# Altium schematic sheet State.SchDoc
size A4
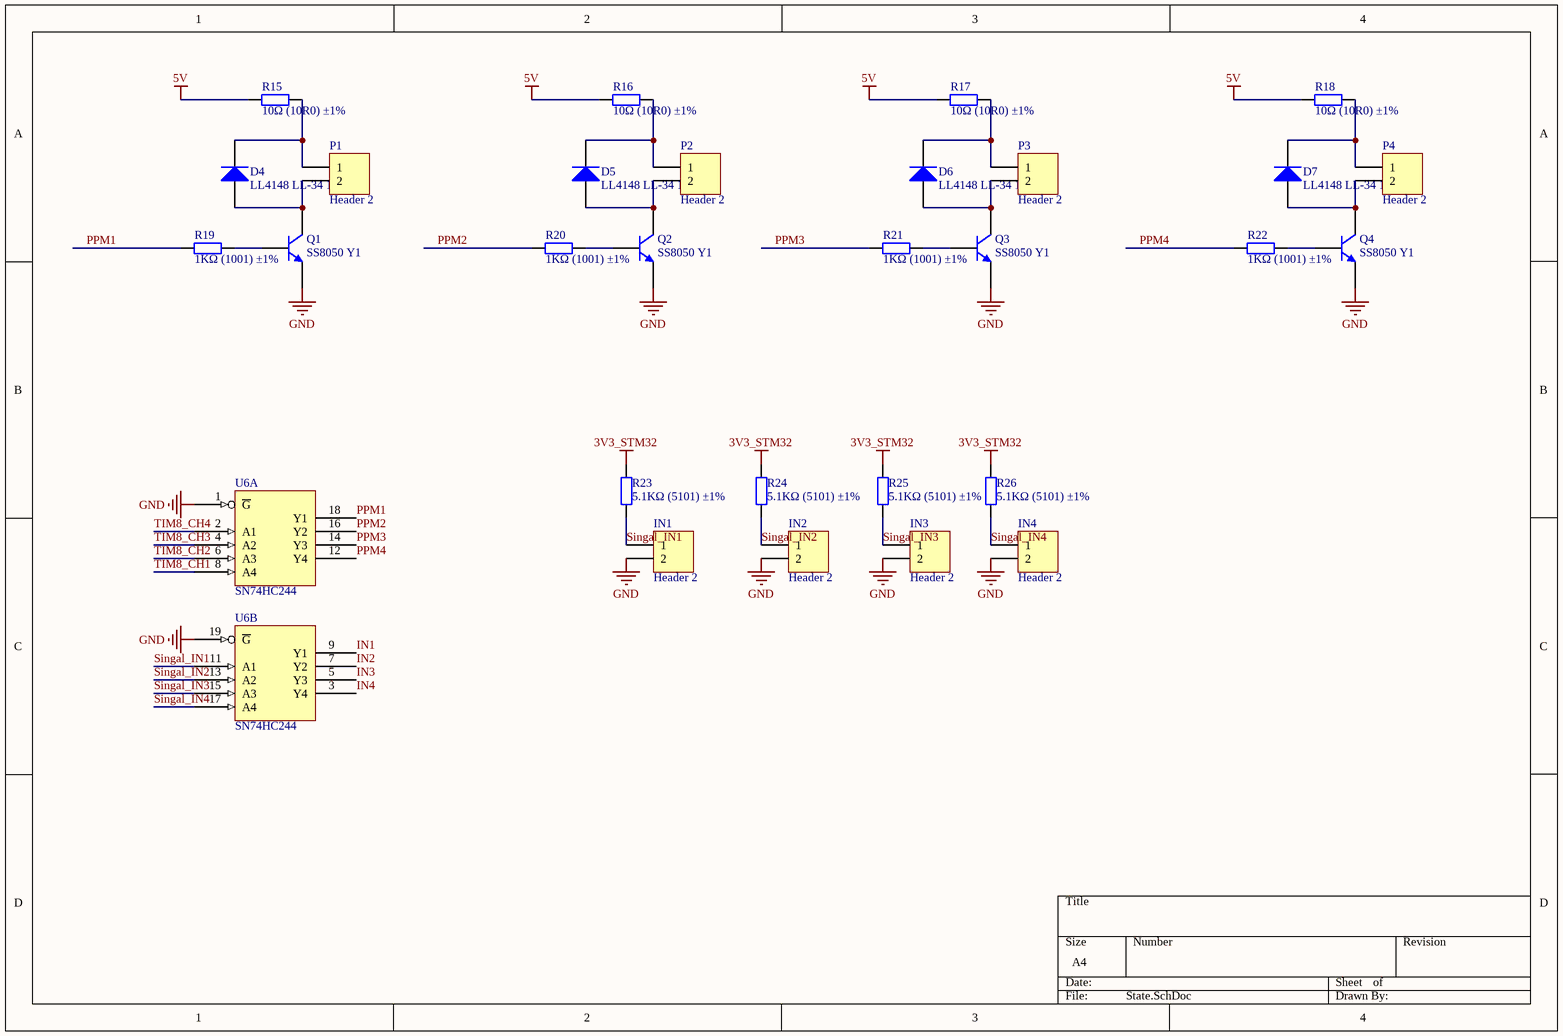
[diagram p0: State.SchDoc]

## Parts
D4  LL4148 LL-34 1206  [LL-34]
D5  LL4148 LL-34 1206  [LL-34]
D6  LL4148 LL-34 1206  [LL-34]
D7  LL4148 LL-34 1206  [LL-34]
IN1  Header 2  [XH2.54_2P]
IN2  Header 2  [XH2.54_2P]
IN3  Header 2  [XH2.54_2P]
IN4  Header 2  [XH2.54_2P]
P1  Header 2  [XH2.54_2P]
P2  Header 2  [XH2.54_2P]
P3  Header 2  [XH2.54_2P]
P4  Header 2  [XH2.54_2P]
Q1  SS8050 Y1  [SOT-23(SOT-23-3)]
Q2  SS8050 Y1  [SOT-23(SOT-23-3)]
Q3  SS8050 Y1  [SOT-23(SOT-23-3)]
Q4  SS8050 Y1  [SOT-23(SOT-23-3)]
R15  10Ω (10R0) ±1%  [1206_R]
R16  10Ω (10R0) ±1%  [1206_R]
R17  10Ω (10R0) ±1%  [1206_R]
R18  10Ω (10R0) ±1%  [1206_R]
R19  1KΩ (1001) ±1%  [0603_R]
R20  1KΩ (1001) ±1%  [0603_R]
R21  1KΩ (1001) ±1%  [0603_R]
R22  1KΩ (1001) ±1%  [0603_R]
R23  5.1KΩ (5101) ±1%  [LC-0603_R]
R24  5.1KΩ (5101) ±1%  [LC-0603_R]
R25  5.1KΩ (5101) ±1%  [LC-0603_R]
R26  5.1KΩ (5101) ±1%  [LC-0603_R]
U6  SN74HC244  [SOIC-20_300mil]  (parts A,B of 2)

## Nets
3V3: U6.20(VCC)
3V3_STM32: R23.2 R24.2 R25.2 R26.2
5V: R15.2 R16.2 R17.2 R18.2
GND: IN1.2 IN2.2 IN3.2 IN4.2 Q1.2(E) Q2.2(E) Q3.2(E) Q4.2(E) U6.1(~{G}) U6.10(GND) U6.19(~{G})
IN1: U6.9(Y1)
IN2: U6.7(Y2)
IN3: U6.5(Y3)
IN4: U6.3(Y4)
PPM1: R19.1 U6.18(Y1)
PPM2: R20.1 U6.16(Y2)
PPM3: R21.1 U6.14(Y3)
PPM4: R22.1 U6.12(Y4)
Singal_IN1: IN1.1 R23.1 U6.11(A1)
Singal_IN2: IN2.1 R24.1 U6.13(A2)
Singal_IN3: IN3.1 R25.1 U6.15(A3)
Singal_IN4: IN4.1 R26.1 U6.17(A4)
TIM8_CH1: U6.8(A4)
TIM8_CH2: U6.6(A3)
TIM8_CH3: U6.4(A2)
TIM8_CH4: U6.2(A1)
NetD4_1: D4.1(A) P1.2 Q1.3(C)
NetD4_2: D4.2(K) P1.1 R15.1
NetD5_1: D5.1(A) P2.2 Q2.3(C)
NetD5_2: D5.2(K) P2.1 R16.1
NetD6_1: D6.1(A) P3.2 Q3.3(C)
NetD6_2: D6.2(K) P3.1 R17.1
NetD7_1: D7.1(A) P4.2 Q4.3(C)
NetD7_2: D7.2(K) P4.1 R18.1
NetQ1_1: Q1.1(B) R19.2
NetQ2_1: Q2.1(B) R20.2
NetQ3_1: Q3.1(B) R21.2
NetQ4_1: Q4.1(B) R22.2

## Library data of the parts
D4-D7 = LL-34 LL4148 LL-34 1206: 开关二极管; ComponentLink1Description: 供应商链接; ComponentLink1URL: http://www.szlcsc.com/product/details_10338.html; Package: LL-34; Supplier: LC; SuppliersPartNumber: C9808
IN1-IN4 P1-P4 = Header 2: Header, 2-Pin; LatestRevisionDate: 17-Jul-2002; LatestRevisionNote: Re-released for DXP Platform.; Publisher: Altium Limited
Q1-Q4 = SOT-23 SS8050 Y1: 三极管; ComponentLink1Description: 供应商链接; ComponentLink1URL: http://www.szlcsc.com/product/details_2507.html; Package: SOT-23; Supplier: LC; SuppliersPartNumber: C2150
R15-R18 = 1206 10Ω (10R0) 1%: 贴片电阻; ComponentLink1Description: 供应商链接; ComponentLink1URL: http://www.szlcsc.com/product/details_18591.html; Package: 1206; Supplier: LC; SuppliersPartNumber: C17903
R19-R22 = 0603 1KΩ (1001) 1%: 贴片电阻; ComponentLink1Description: 供应商链接; ComponentLink1URL: http://www.szlcsc.com/product/details_21904.html; Package: 0603; Supplier: LC; SuppliersPartNumber: C21190
R23-R26 = 0603 5.1KΩ (5101) 1%: 贴片电阻; ComponentLink1Description: 供应商链接; ComponentLink1URL: http://www.szlcsc.com/product/details_23913.html; Package: 0603; Supplier: LC; SuppliersPartNumber: C23186
U6 = SN74HC244: OCTAL BUF AND LIN DRV 3SO